# Altium schematic sheet Main.SchDoc
size A4; SheetNumber: 1; SheetTotal: 1
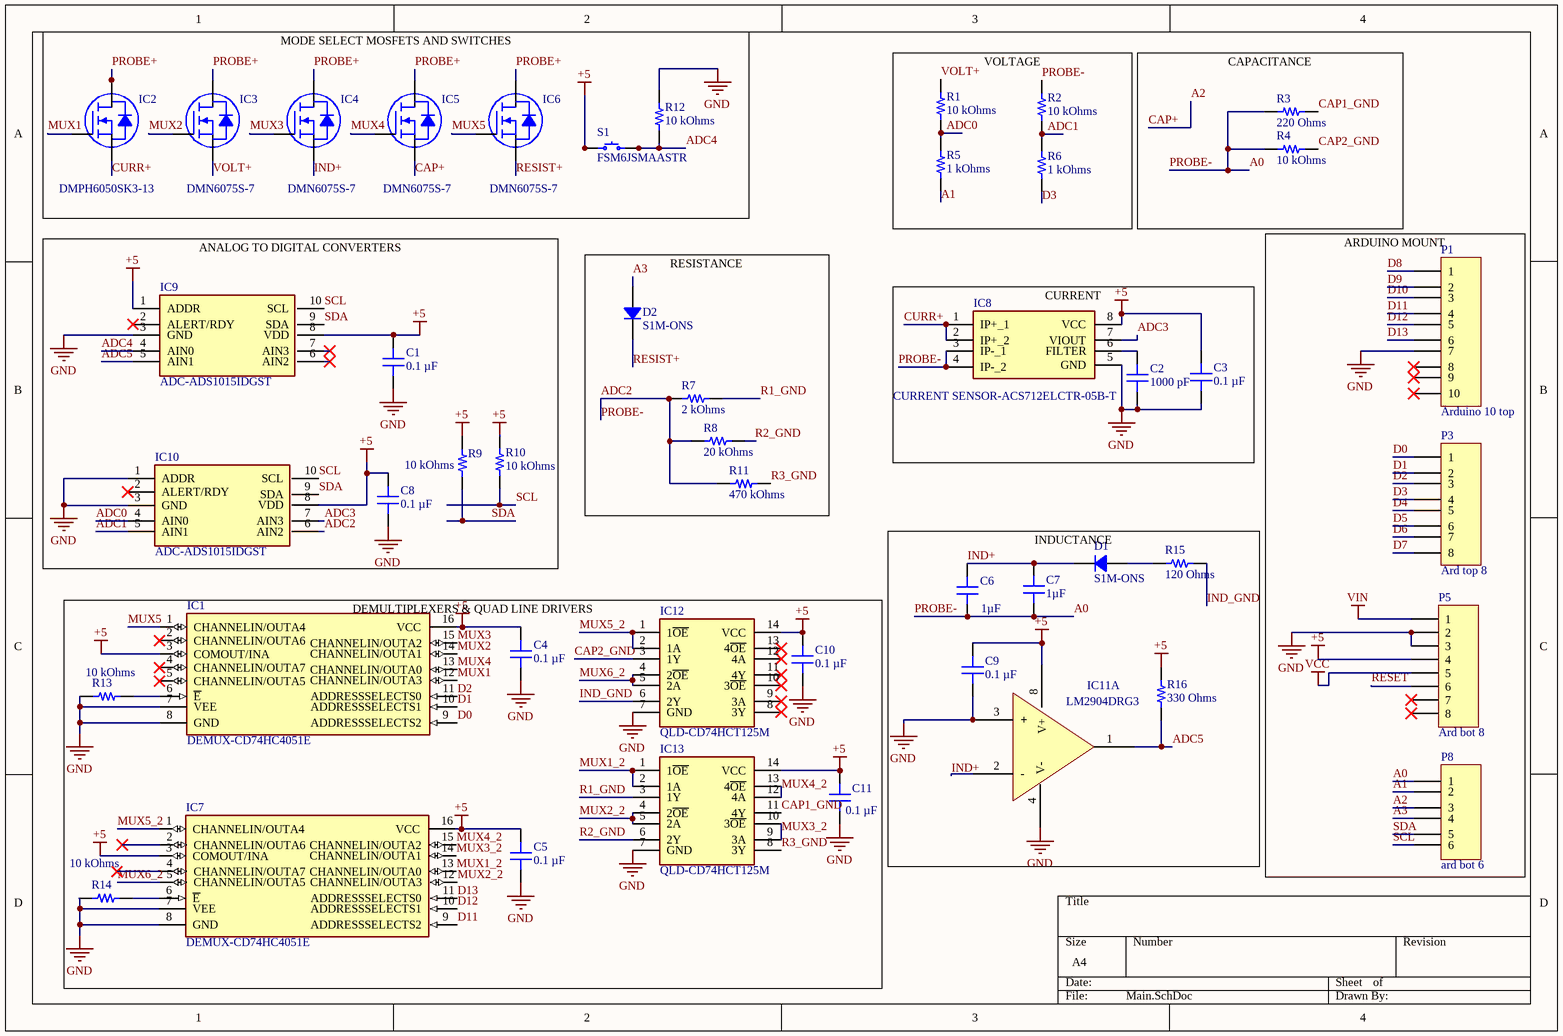
[diagram p0: Main.SchDoc]

## Parts
C1  0.1 µF  [CAP 0805_2012]
C2  1000 pF  [CAP 0805_2012]
C3  0.1 µF  [CAP 0805_2012]
C4  0.1 µF  [CAP 0805_2012]
C5  0.1 µF  [CAP 0805_2012]
C6  1µF  [CAP 0805_2012]
C7  1µF  [CAP 0805_2012]
C8  0.1 µF  [CAP 0805_2012]
C9  0.1 µF  [CAP 0805_2012]
C10  0.1 µF  [CAP 0805_2012]
C11  0.1 µF  [CAP 0805_2012]
D1  S1M-ONS  [DO214AC SMA]
D2  S1M-ONS  [DO214AC SMA]
IC1  DEMUX-CD74HC4051E  [DIP794W53P254L1930H508Q16N]
IC2  DMPH6050SK3-13  [INFINEON PG-TO 252 GDS FET]
IC3  DMN6075S-7  [DIODES SOT-23-3]
IC4  DMN6075S-7  [DIODES SOT-23-3]
IC5  DMN6075S-7  [DIODES SOT-23-3]
IC6  DMN6075S-7  [DIODES SOT-23-3]
IC7  DEMUX-CD74HC4051E  [DIP794W53P254L1930H508Q16N]
IC8  CURRENT SENSOR-ACS712ELCTR-05B-T  [SOIC127P600X175-8N]
IC9  ADC-ADS1015IDGST  [SOP50P490X110-10N]
IC10  ADC-ADS1015IDGST  [SOP50P490X110-10N]
IC11  LM2904DRG3  [TI SOIC-8 D]  (part A of 2)
IC12  QLD-CD74HCT125M  [SOIC127P600X175-14N]
IC13  QLD-CD74HCT125M  [SOIC127P600X175-14N]
P1  Arduino 10 top  [HDR1X10]
P3  Ard top 8  [HDR1X8]
P5  Ard bot 8  [HDR1X8]
P8  ard bot 6  [HDR1X6]
R1  10 kOhms  [RES 0805_2012]
R2  10 kOhms  [RES 0805_2012]
R3  220 Ohms  [RES 0805_2012]
R4  10 kOhms  [RES 0805_2012]
R5  1 kOhms  [RES 0805_2012]
R6  1 kOhms  [RES 0805_2012]
R7  2 kOhms  [RES 0805_2012]
R8  20 kOhms  [RES 0805_2012]
R9  10 kOhms  [RES 0805_2012]
R10  10 kOhms  [RES 0805_2012]
R11  470 kOhms  [RES 0805_2012]
R12  10 kOhms  [RES 0805_2012]
R13  10 kOhms  [RES 0805_2012]
R14  10 kOhms  [RES 0805_2012]
R15  120 Ohms  [RES 0805_2012]
R16  330 Ohms  [RES 0805_2012]
S1  FSM6JSMAASTR  [TE FSM6JSMA]

## Nets
+5: C1.2 C3.2 C4.2 C5.2 C8.2 C9.2 C10.2 C11.2 IC1.3(COMOUT/INA) IC1.16(VCC) IC7.3(COMOUT/INA) IC7.16(VCC) IC8.8(VCC) IC9.1(ADDR) IC9.8(VDD) IC10.8(VDD) IC11.8(V+) IC12.14(VCC) IC13.14(VCC) P5.4 R9.2 R10.2 R16.2 S1.1 S1.2
GND: C1.1 C2.1 C3.1 C4.1 C5.1 C8.1 C9.1 C10.1 C11.1 IC1.7(VEE) IC1.8(GND) IC7.7(VEE) IC7.8(GND) IC8.5(GND) IC9.3(GND) IC10.1(ADDR) IC10.3(GND) IC11.3(+) IC11.4(V-) IC12.7(GND) IC13.7(GND) P1.7 P5.2 P5.3 R12.2 R13.2 R14.2
VCC: P5.5
VIN: P5.1
A0: C6.1 C7.1 IC8.3(IP-_1) IC8.4(IP-_2) IC10.6(AIN2) P8.1 R2.2 R3.1 R4.2 R7.2 R8.2 R11.2  [also labelled ADC2, PROBE-]
A1: P8.2 R5.1
A2: IC5.2(S) P8.3  [also labelled CAP+]
A3: D2.1 P8.4
ADC0: IC10.4(AIN0) R1.1 R5.2
ADC1: IC10.5(AIN1) R2.1 R6.2
ADC3: IC8.7(VIOUT) IC10.7(AIN3)
ADC4: IC9.4(AIN0) R12.1 S1.3 S1.4
ADC5: IC9.5(AIN1) IC11.1(OUTA) R16.1
CAP1_GND: IC13.11(4Y) R3.2
CAP2_GND: IC12.3(1Y) R4.1
CURR+: IC2.S IC8.1(IP+_1) IC8.2(IP+_2)
D0: IC1.9(ADDRESSSELECTS2) P3.1
D1: IC1.10(ADDRESSSELECTS1) P3.2
D2: IC1.11(ADDRESSSELECTS0) P3.3
D3: P3.4 R6.1
D4: P3.5
D5: P3.6
D6: P3.7
D7: P3.8
D8: P1.1
D9: P1.2
D10: P1.3
D11: IC7.9(ADDRESSSELECTS2) P1.4
D12: IC7.10(ADDRESSSELECTS1) P1.5
D13: IC7.11(ADDRESSSELECTS0) P1.6
IND+: C6.2 C7.2 D1.2 IC4.2(S) IC11.2(-)
IND_GND: IC12.6(2Y) R15.2
MUX1: IC1.12(CHANNELIN/OUTA3) IC2.G
MUX1_2: IC7.13(CHANNELIN/OUTA0) IC13.1(1~{OE}) IC13.2(1A)
MUX2: IC1.14(CHANNELIN/OUTA1) IC3.1(G)
MUX2_2: IC7.12(CHANNELIN/OUTA3) IC13.4(2~{OE}) IC13.5(2A)
MUX3: IC1.15(CHANNELIN/OUTA2) IC4.1(G)
MUX3_2: IC7.14(CHANNELIN/OUTA1) IC13.9(3A) IC13.10(3~{OE})
MUX4: IC1.13(CHANNELIN/OUTA0) IC5.1(G)
MUX4_2: IC7.15(CHANNELIN/OUTA2) IC13.12(4A) IC13.13(4~{OE})
MUX5: IC1.1(CHANNELIN/OUTA4) IC6.1(G)
MUX5_2: IC7.1(CHANNELIN/OUTA4) IC12.1(1~{OE}) IC12.2(1A)
MUX6_2: IC7.5(CHANNELIN/OUTA5) IC12.4(2~{OE}) IC12.5(2A)
PROBE+: IC2.D IC3.3(D) IC4.3(D) IC5.3(D) IC6.3(D)
R1_GND: IC13.3(1Y) R7.1
R2_GND: IC13.6(2Y) R8.1
R3_GND: IC13.8(3Y) R11.1
RESET: P5.6
RESIST+: D2.2 IC6.2(S)
SCL: IC9.10(SCL) IC10.10(SCL) P8.6 R10.1
SDA: IC9.9(SDA) IC10.9(SDA) P8.5 R9.1
VOLT+: IC3.2(S) R1.2
NetC2_2: C2.2 IC8.6(FILTER)
NetD1_1: D1.1 R15.1
NetIC1_6: IC1.6(~{E}) R13.1
NetIC7_6: IC7.6(~{E}) R14.1

Not connected (* = marked no-connect by the designer): IC1 2(CHANNELIN/OUTA6)* 4(CHANNELIN/OUTA7)* 5(CHANNELIN/OUTA5)*; IC7 2(CHANNELIN/OUTA6)* 4(CHANNELIN/OUTA7)*; IC9 2(ALERT/RDY)* 6(AIN2)* 7(AIN3)*; IC10 2(ALERT/RDY)*; IC12 8(3Y)* 9(3A)* 10(3~{OE})* 11(4Y)* 12(4A)* 13(4~{OE})*; P1 8* 9* 10*; P5 7* 8*

## Notes on the sheet
- MODE SELECT MOSFETS AND SWITCHES
- VOLTAGE
- CAPACITANCE
- RESISTANCE
- CURRENT
- ANALOG TO DIGITAL CONVERTERS
- INDUCTANCE
- ARDUINO MOUNT
- DEMULTIPLEXERS & QUAD LINE DRIVERS

## Library data of the parts
C1 C3-C5 C8-C11 = CC0805MRX7R9BB104: CAP CER 0.1UF 50V X7R 0805; manufacturer: Yageo; Tolerance: ±20%; Part Number: CC0805MRX7R9BB104; Capacitance: 0.1 µF; Applications: General Purpose; componentlink1description: Datasheet; componentlink1url: https://www.yageo.com/upload/media/product/productsearch/datasheet/mlcc/UPY-GPHC_X7R_6.3V-to-50V_18.pdf; componentlink2description: DigiKey Link; componentlink2url: https://www.digikey.com/en/products/detail/yageo/CC0805MRX7R9BB104/5884281; Device Package: 0805 (2012 Metric); lastupdated: 09/02/2024 20:16:09; Lifecycle Status: Active; Minimum Order: 1; Mounting Type: Surface Mount, MLCC; Operating Temperature: -55°C ~ 125°C; Package / Case: 0805 (2012 Metric); packaging: TapeAndReel; partid: 2475; Part Status: Active; price: 0.01; series: CC; Size / Dimension: 0.079" L x 0.049" W (2.00mm x 1.25mm); Supplier 1: DigiKey; Supplier Part Number 1: 311-4351-1-ND; Temperature Coefficient: X7R; Thickness (Max): 0.037" (0.95mm); value: 0.1 µF; Voltage - Rated: 50V
C2 = KGM21NR72D102KT: CAP CER 1000PF 200V X7R 0805; manufacturer: KYOCERA AVX; Tolerance: ±10%; Part Number: KGM21NR72D102KT; Capacitance: 1000 pF; Applications: General Purpose; componentlink1description: Datasheet; componentlink1url: https://datasheets.kyocera-avx.com/X7RDielectric.pdf; componentlink2description: DigiKey Link; componentlink2url: https://www.digikey.com/en/products/detail/kyocera-avx/KGM21NR72D102KT/563449; Device Package: 0805 (2012 Metric); lastupdated: 09/02/2024 20:14:03; Lifecycle Status: Active; Minimum Order: 1; Mounting Type: Surface Mount, MLCC; Operating Temperature: -55°C ~ 125°C; Package / Case: 0805 (2012 Metric); packaging: TapeAndReel; partid: 53503; Part Status: Active; price: 0.02; series: KGM - X7R; Size / Dimension: 0.079" L x 0.049" W (2.01mm x 1.25mm); Supplier 1: DigiKey; Supplier Part Number 1: 478-KGM21NR72D102KTCT-ND; Temperature Coefficient: X7R; Thickness (Max): 0.039" (1.00mm); value: 1000 pF; Voltage - Rated: 200V
C6 C7 = MM05ZC105KCZ2A: CAP CER 1UF 10V X7R 0805; manufacturer: AVX Corporation; Tolerance: ±10%; Part Number: MM05ZC105KCZ2A; Capacitance: 1µF; Applications: Medical, Non-Critical; componentlink1description: Datasheet; componentlink1url: http://datasheets.avx.com/AVX-MM.pdf; componentlink2description: DigiKey Link; componentlink2url: http://digikey.com/product-detail/en/avx-corporation/MM05ZC105KCZ2A/478-10611-1-ND/7344872; Device Package: 0805 (2012 Metric); lastupdated: 02/09/2020 01:04:42; Lifecycle Status: Active; Minimum Order: 1; Mounting Type: Surface Mount, MLCC; Operating Temperature: -55°C ~ 125°C; Package / Case: 0805 (2012 Metric); packaging: TapeAndReel; partid: 2439; Part Status: Active; price: 0.50; series: MM; Size / Dimension: 0.079" L x 0.049" W (2.01mm x 1.25mm); Supplier 1: DigiKey; Supplier Part Number 1: 478-10611-1-ND; Temperature Coefficient: X7R; Thickness (Max): 0.029" (0.74mm); value: 1µF; Voltage - Rated: 10V
D1 D2 = RS1A: DIODE GEN PURP 50V 1A SMA; Part Number: RS1A; Manufacturer: ON Semiconductor; Capacitance @ Vr, F: 10pF @ 4V, 1MHz; Current - Reverse Leakage @ Vr: 5µA @ 50V; Diode Type: Standard; Reverse Recovery Time (trr): 150ns; Speed: Fast Recovery =< 500ns, > 200mA (Io); Voltage - Forward (Vf) (Max) @ If: 1.3V @ 1A; ComponentLink1Description: Datasheet; ComponentLink1URL: https://www.onsemi.com/pub/Collateral/RS1M-D.PDF; ComponentLink2Description: DigiKey Link; ComponentLink2URL: http://digikey.com/product-detail/en/on-semiconductor/RS1A/RS1ACT-ND/3504478; Current - Average Rectified (Io): 1A; LastUpdated: 03/06/2024 19:54:38; Lifecycle Status: Active; Minimum Order: 1; Mounting Type: Surface Mount; Operating Temperature - Junction: -55°C ~ 150°C; Package / Case: DO-214AC, SMA; Packaging: TapeAndReel; PartId: 585; Part Status: Active; Price: 0.08; Series: -; Supplier 1: DigiKey; Supplier Part Number 1: RS1ACT-ND; Supplier Device Package: SMA (DO-214AC); Voltage - DC Reverse (Vr) (Max): 50V
IC1 IC7 = CD74HC4051E: Integrated Circuit; Manufacturer_Name: Texas Instruments; Datasheet Link: http://www.ti.com/lit/ds/symlink/cd74hc4051.pdf; Height: 5.08mm; Manufacturer_Part_Number: CD74HC4051E; Mouser Part Number: 595-CD74HC4051E; Mouser Price/Stock: https://www.mouser.co.uk/ProductDetail/Texas-Instruments/CD74HC4051E?qs=LfG3tU9ud8CbsH7xUrF9XA%3D%3D; Arrow Part Number: CD74HC4051E; Arrow Price/Stock: https://www.arrow.com/en/products/cd74hc4051e/texas-instruments?region=europe
IC2 = IPD80R2K8CEATMA1: MOSFET N-CH 800V 1.9A TO252-3; Manufacturer: Infineon Technologies; Current - Continuous Drain (Id) @ 25°C: 1.9A (Tc); Drive Voltage (Max Rds On,  Min Rds On): 10V; FET Type: N-Channel; Gate Charge (Qg) (Max) @ Vgs: 12 nC @ 10 V; Input Capacitance (Ciss) (Max) @ Vds: 290 pF @ 100 V; Power Dissipation (Max): 42W (Tc); Rds On (Max) @ Id, Vgs: 2.8Ohm @ 1.1A, 10V; Vgs (Max): ±20V; Vgs(th) (Max) @ Id: 3.9V @ 120µA; Part Number: IPD80R2K8CEATMA1; ComponentLink1Description: Datasheet; ComponentLink1URL: https://www.infineon.com/dgdl/Infineon-IPX80R2K8CE-DS-v02_01-en.pdf?fileId=db3a304340155f3d01402f5e5f1f274f; ComponentLink2Description: DigiKey Link; ComponentLink2URL: https://www.digikey.com/en/products/detail/infineon-technologies/IPD80R2K8CEATMA1/5960265; Drain to Source Voltage (Vdss): 800 V; LastUpdated: 03/06/2024 20:26:42; Lifecycle Status: Active; Minimum Order: 1; Mounting Type: Surface Mount; Operating Temperature: -55°C ~ 150°C (TJ); Package / Case: TO-252-3, DPak (2 Leads + Tab), SC-63; Packaging: TapeAndReel; Part Status: Active; Price: 0.39; Series: CoolMOS™ CE; Supplier 1: DigiKey; Supplier Part Number 1: IPD80R2K8CEATMA1CT-ND; Supplier Device Package: PG-TO252-3; Technology: MOSFET (Metal Oxide)
IC3-IC6 = DMN6075S-7: MOSFET N-CH 60V 2A SOT23; Manufacturer: Diodes Incorporated; Current - Continuous Drain (Id) @ 25°C: 2A (Ta); Drive Voltage (Max Rds On,  Min Rds On): 4.5V, 10V; FET Type: N-Channel; Gate Charge (Qg) (Max) @ Vgs: 12.3 nC @ 10 V; Input Capacitance (Ciss) (Max) @ Vds: 606 pF @ 20 V; Power Dissipation (Max): 800mW (Ta); Rds On (Max) @ Id, Vgs: 85mOhm @ 3.2A, 10V; Vgs (Max): ±20V; Vgs(th) (Max) @ Id: 3V @ 250µA; Part Number: DMN6075S-7; ComponentLink1Description: Datasheet; ComponentLink1URL: https://www.diodes.com/assets/Datasheets/DMN6075S.pdf; ComponentLink2Description: DigiKey Link; ComponentLink2URL: https://www.digikey.com/en/products/detail/diodes-incorporated/DMN6075S-7/5149292; Drain to Source Voltage (Vdss): 60 V; LastUpdated: 03/06/2024 20:15:18; Lifecycle Status: Active; Minimum Order: 1; Mounting Type: Surface Mount; Operating Temperature: -55°C ~ 150°C (TJ); Package / Case: TO-236-3, SC-59, SOT-23-3; Packaging: TapeAndReel; Part Status: Active; Price: 0.05; Series: -; Supplier 1: DigiKey; Supplier Part Number 1: DMN6075S-7DICT-ND; Supplier Device Package: SOT-23-3; Technology: MOSFET (Metal Oxide)
IC8 = ACS712ELCTR-05B-T: Integrated Circuit; Manufacturer_Name: Allegro Microsystems; Datasheet Link: https://www.allegromicro.com/~/media/Files/Datasheets/ACS712-Datasheet.ashx; Height: 1.75mm; Manufacturer_Part_Number: ACS712ELCTR-05B-T; Mouser Part Number: 250-712ELCTR05BT; Mouser Price/Stock: https://www.mouser.co.uk/ProductDetail/Allegro-MicroSystems/ACS712ELCTR-05B-T?qs=pUKx8fyJudDs65Rkshv5ug%3D%3D; Arrow Part Number: ACS712ELCTR-05B-T; Arrow Price/Stock: https://www.arrow.com/en/products/acs712elctr-05b-t/allegro-microsystems?utm_currency=USD&region=nac
IC9 IC10 = ADS1015IDGST: Integrated Circuit; Manufacturer_Name: Texas Instruments; Datasheet Link: https://datasheet.datasheetarchive.com/originals/distributors/SFDatasheet-7/sf-000145393.pdf; Height: 1.1mm; Manufacturer_Part_Number: ADS1015IDGST; Mouser Part Number: 595-ADS1015IDGST; Mouser Price/Stock: https://www.mouser.co.uk/ProductDetail/Texas-Instruments/ADS1015IDGST?qs=IK5e5L0zOXh9z6MvmmS6pA%3D%3D; Arrow Part Number: ADS1015IDGST; Arrow Price/Stock: https://www.arrow.com/en/products/ads1015idgst/texas-instruments?utm_currency=USD&region=nac
IC11 = LM2904DRG3: IC OPAMP GP 2 CIRCUIT 8SOIC; Manufacturer: Texas Instruments; Amplifier Type: General Purpose; Current - Input Bias: 20nA; Current - Output / Channel: 30mA; Current - Supply: 1mA; Gain Bandwidth Product: 700kHz; Number of Circuits: 2; Slew Rate: 0.3V/µs; Voltage - Input Offset: 3mV; Voltage - Supply, Single/Dual (±): 3V ~ 26V, ±1.5V ~ 13V; Part Number: LM2904DRG3; ComponentLink1Description: Datasheet; ComponentLink1URL: http://www.ti.com/general/docs/suppproductinfo.tsp?distId=10&gotoUrl=http%3A%2F%2Fwww.ti.com%2Flit%2Fgpn%2Flm258a; ComponentLink2Description: DigiKey Link; ComponentLink2URL: http://digikey.com/product-detail/en/texas-instruments/LM2904DRG3/296-27464-1-ND/2297366; Device Package: 8-SOIC (0.154", 3.90mm Width); LastUpdated: 09/01/2020 02:06:06; Lifecycle Status: Active; Minimum Order: 1; Mounting Type: Surface Mount; Operating Temperature: -40°C ~ 125°C; Package / Case: 8-SOIC (0.154", 3.90mm Width); Packaging: ReReel; PartId: 14; Part Status: Active; Price: 0.00; Series: -; Supplier 1: DigiKey; Supplier Part Number 1: 296-27464-1-ND; Supplier Device Package: 8-SOIC
IC12 IC13 = CD74HCT125M: Integrated Circuit; Manufacturer_Name: Texas Instruments; Datasheet Link: http://www.ti.com/lit/ds/symlink/cd74hct125.pdf; Height: 1.75mm; Manufacturer_Part_Number: CD74HCT125M; Mouser Part Number: 595-CD74HCT125M; Mouser Price/Stock: https://www.mouser.co.uk/ProductDetail/Texas-Instruments/CD74HCT125M?qs=D5pVkbrsqqIXfx0uwi2SiA%3D%3D; Arrow Part Number: CD74HCT125M; Arrow Price/Stock: https://www.arrow.com/en/products/cd74hct125m/texas-instruments
P1 = Header 10: Header, 10-Pin; LatestRevisionDate: 17-Jul-2002; LatestRevisionNote: Re-released for DXP Platform.; Publisher: Altium Limited
P3 P5 = Header 8: Header, 8-Pin; LatestRevisionDate: 17-Jul-2002; LatestRevisionNote: Re-released for DXP Platform.; Publisher: Altium Limited
P8 = Header 6: Header, 6-Pin; LatestRevisionDate: 17-Jul-2002; LatestRevisionNote: Re-released for DXP Platform.; Publisher: Altium Limited
R1 R2 R4 R9 R10 R12-R14 = RNCS0805BKE10K0: RES 10K OHM 0.1% 1/10W 0805; Manufacturer: Stackpole Electronics Inc; Power (Watts): 0.1W, 1/10W; Temperature Coefficient: ±25ppm/°C; Part Number: RNCS0805BKE10K0; Value: 10 kOhms; ComponentLink1Description: Datasheet; ComponentLink1URL: https://www.seielect.com/catalog/sei-rncs_rnch.pdf; ComponentLink2Description: DigiKey Link; ComponentLink2URL: https://www.digikey.com/en/products/detail/stackpole-electronics-inc/RNCS0805BKE10K0/1800067; Composition: Thin Film; Device Package: 0805 (2012 Metric); Features: Anti-Corrosive, Automotive AEC-Q200, Moisture Resistant; Height - Seated (Max): 0.026" (0.65mm); LastUpdated: 08/02/2024 21:02:39; Lifecycle Status: Active; Minimum Order: 1; Number of Terminations: 2; Operating Temperature: -55°C ~ 155°C; Package / Case: 0805 (2012 Metric); Packaging: TapeAndReel; PartId: 27713; Part Status: Active; Price: 0.07; Ratings: AEC-Q200; Resistance: 10 kOhms; Series: RNCS; Size / Dimension: 0.079" L x 0.049" W (2.00mm x 1.25mm); Supplier 1: DigiKey; Supplier Part Number 1: RNCS0805BKE10K0CT-ND; Supplier Device Package: 0805; Tolerance: ±0.1%
R3 = ESR10EZPF2200: RES SMD 220 OHM 1% 0.4W 0805; Manufacturer: Rohm Semiconductor; Power (Watts): 0.4W, 2/5W; Temperature Coefficient: ±100ppm/°C; Part Number: ESR10EZPF2200; Value: 220 Ohms; ComponentLink1Description: Datasheet; ComponentLink1URL: https://www.rohm.com/datasheet/ESR01MZPF/esr-e; ComponentLink2Description: DigiKey Link; ComponentLink2URL: https://www.digikey.com/en/products/detail/rohm-semiconductor/ESR10EZPF2200/1983511; Composition: Thick Film; Device Package: 0805 (2012 Metric); Features: Automotive AEC-Q200, Pulse Withstanding; Height - Seated (Max): 0.026" (0.65mm); LastUpdated: 08/02/2024 21:02:37; Lifecycle Status: Active; Minimum Order: 1; Number of Terminations: 2; Operating Temperature: -55°C ~ 155°C; Package / Case: 0805 (2012 Metric); Packaging: TapeAndReel; PartId: 28037; Part Status: Active; Price: 0.02; Ratings: AEC-Q200; Resistance: 220 Ohms; Series: ESR; Size / Dimension: 0.079" L x 0.049" W (2.00mm x 1.25mm); Supplier 1: DigiKey; Supplier Part Number 1: RHM220AECT-ND; Supplier Device Package: 0805; Tolerance: ±1%
R5-R8 R11 = RNCS0805BKE10K0: RES 10K OHM 0.1% 1/10W 0805; Manufacturer: Stackpole Electronics Inc; Power (Watts): 0.1W, 1/10W; Resistance: 10 kOhms; Temperature Coefficient: ±25ppm/°C; Part Number: RNCS0805BKE10K0; ComponentLink1Description: Datasheet; ComponentLink1URL: https://www.seielect.com/catalog/sei-rncs_rnch.pdf; ComponentLink2Description: DigiKey Link; ComponentLink2URL: https://www.digikey.com/en/products/detail/stackpole-electronics-inc/RNCS0805BKE10K0/1800067; Composition: Thin Film; Device Package: 0805 (2012 Metric); Features: Anti-Corrosive, Automotive AEC-Q200, Moisture Resistant; Height - Seated (Max): 0.026" (0.65mm); LastUpdated: 08/02/2024 21:02:39; Lifecycle Status: Active; Minimum Order: 1; Number of Terminations: 2; Operating Temperature: -55°C ~ 155°C; Package / Case: 0805 (2012 Metric); Packaging: TapeAndReel; PartId: 27713; Part Status: Active; Price: 0.07; Ratings: AEC-Q200; Series: RNCS; Size / Dimension: 0.079" L x 0.049" W (2.00mm x 1.25mm); Supplier 1: DigiKey; Supplier Part Number 1: RNCS0805BKE10K0CT-ND; Supplier Device Package: 0805; Tolerance: ±0.1%
  R5 R6: Value: 1 kOhms
  R7: Value: 2 kOhms
  R8: Value: 20 kOhms
  R11: Value: 470 kOhms
R15 = ERJ-6ENF1200V: RES SMD 120 OHM 1% 1/8W 0805; Manufacturer: Panasonic Electronic Components; Power (Watts): 0.125W, 1/8W; Temperature Coefficient: ±100ppm/°C; Part Number: ERJ-6ENF1200V; Value: 120 Ohms; ComponentLink1Description: Datasheet; ComponentLink1URL: https://industrial.panasonic.com/cdbs/www-data/pdf/RDA0000/AOA0000C304.pdf; ComponentLink2Description: DigiKey Link; ComponentLink2URL: https://www.digikey.com/en/products/detail/panasonic-electronic-components/ERJ-6ENF1200V/1746457; Composition: Thick Film; Device Package: 0805 (2012 Metric); Features: Automotive AEC-Q200; Height - Seated (Max): 0.028" (0.70mm); LastUpdated: 08/02/2024 21:02:28; Lifecycle Status: Active; Minimum Order: 1; Number of Terminations: 2; Operating Temperature: -55°C ~ 155°C; Package / Case: 0805 (2012 Metric); Packaging: TapeAndReel; PartId: 30224; Part Status: Active; Price: 0.01; Ratings: AEC-Q200; Resistance: 120 Ohms; Series: ERJ-6EN; Size / Dimension: 0.079" L x 0.049" W (2.00mm x 1.25mm); Supplier 1: DigiKey; Supplier Part Number 1: P120CCT-ND; Supplier Device Package: 0805; Tolerance: ±1%
R16 = CRCW0805330RFKEAHP: RES SMD 330 OHM 1% 1/2W 0805; Manufacturer: Vishay Dale; Power (Watts): 0.5W, 1/2W; Temperature Coefficient: ±100ppm/°C; Part Number: CRCW0805330RFKEAHP; Value: 330 Ohms; ComponentLink1Description: Datasheet; ComponentLink1URL: http://www.vishay.com/docs/20043/crcwhpe3.pdf; ComponentLink2Description: DigiKey Link; ComponentLink2URL: https://www.digikey.com/en/products/detail/vishay-dale/CRCW0805330RFKEAHP/2226912; Composition: Thick Film; Device Package: 0805 (2012 Metric); Features: Automotive AEC-Q200, Pulse Withstanding; Height - Seated (Max): 0.020" (0.50mm); LastUpdated: 08/02/2024 21:02:28; Lifecycle Status: Active; Minimum Order: 1; Number of Terminations: 2; Operating Temperature: -55°C ~ 155°C; Package / Case: 0805 (2012 Metric); Packaging: TapeAndReel; PartId: 30364; Part Status: Active; Price: 0.02; Ratings: AEC-Q200; Resistance: 330 Ohms; Series: CRCW-HP; Size / Dimension: 0.079" L x 0.049" W (2.00mm x 1.25mm); Supplier 1: DigiKey; Supplier Part Number 1: 541-330TCT-ND; Supplier Device Package: 0805; Tolerance: ±1%
S1 = FSM6JSMAASTR: SWITCH TACTILE SPST-NO 0.05A 24V; Manufacturer: TE Connectivity ALCOSWITCH Switches; Actuator Height off PCB, Vertical: 7.00mm; Actuator Orientation: Top Actuated; Actuator Type: Standard; Contact Rating @ Voltage: 0.05A @ 24VDC; Illumination: Non-Illuminated; Operating Force: 260gf; Outline: 6.00mm x 6.00mm; Switch Function: Off-Mom; Part Number: FSM6JSMAASTR; Circuit: SPST-NO; ComponentLink1Description: Datasheet; ComponentLink1URL: https://www.te.com/commerce/DocumentDelivery/DDEController?Action=srchrtrv&DocNm=1308111-1_SWITCHES_CORE_PROGRAM_CATALOG&DocType=CS&DocLang=English; ComponentLink2Description: DigiKey Link; ComponentLink2URL: https://www.digikey.com/en/products/detail/te-connectivity-alcoswitch-switches/FSM6JSMAASTR/5343804; LastUpdated: 03/06/2024 20:19:31; Lifecycle Status: Active; Minimum Order: 1; Mounting Type: Surface Mount; Operating Temperature: -40°C ~ 105°C; Packaging: TapeAndReel; Part Status: Active; Price: 0.30; Series: FSMJSMA; Supplier 1: DigiKey; Supplier Part Number 1: 450-2138-1-ND; Termination Style: Gull Wing